# EAGLE design The Watch v1.1 (EAGLE 9.3.2)
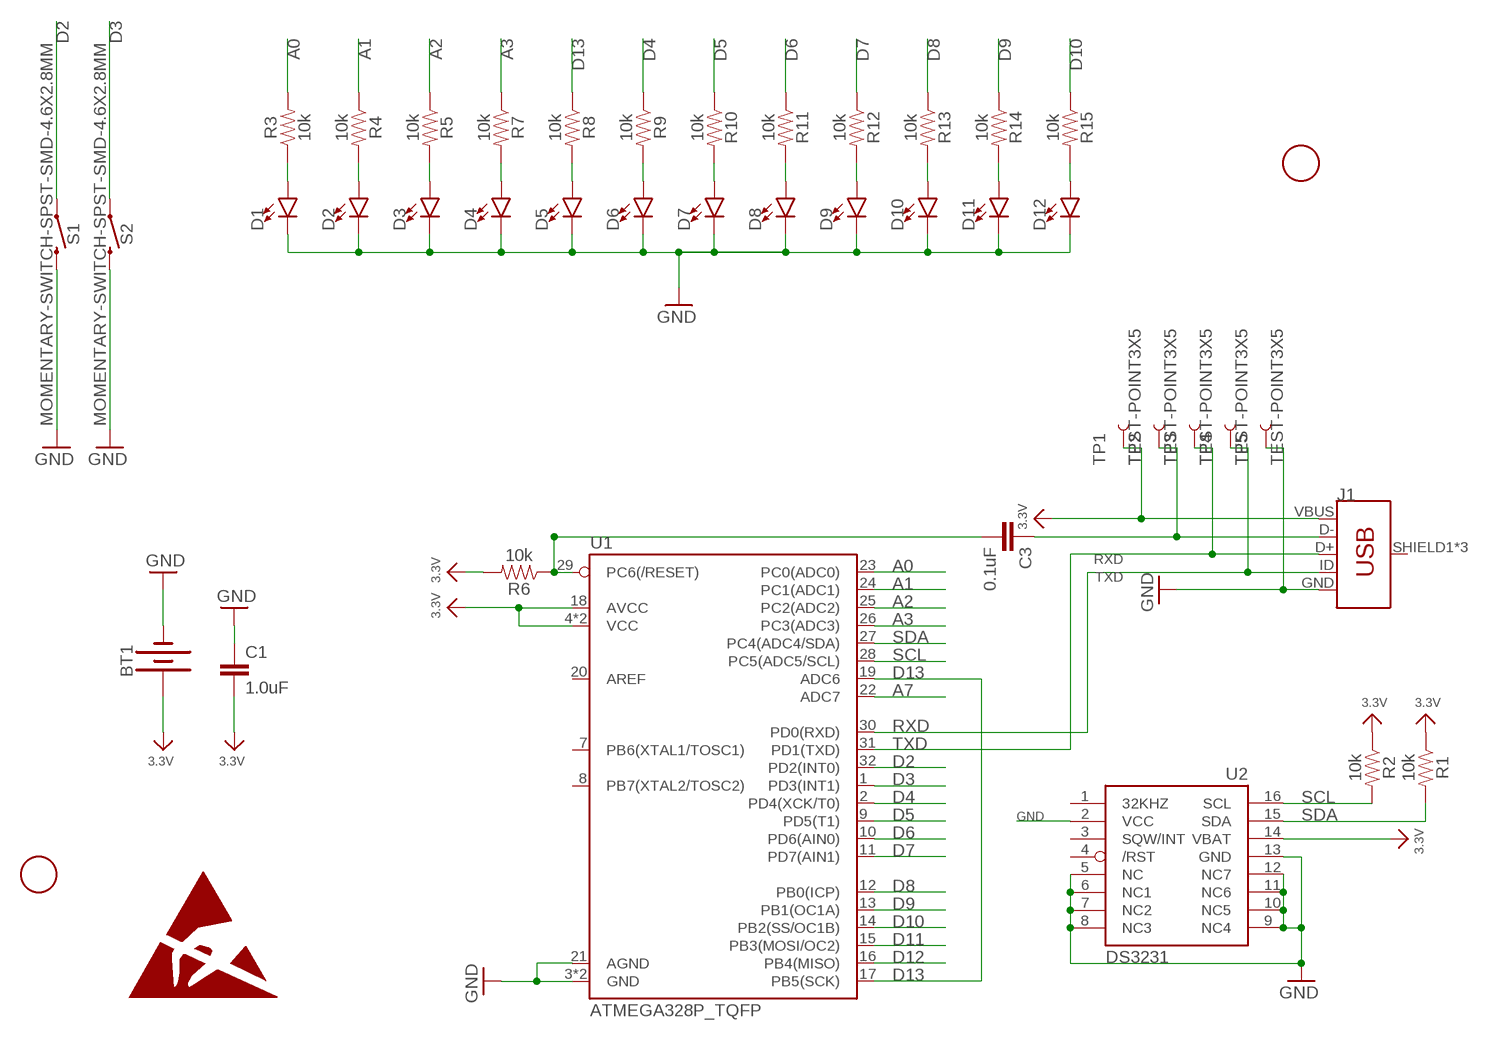
[diagram p0: schematic, sheet 1]

## Parts
BT1  BATTERY-20MM_SMD_4LEGS_OVERPASTE  [BATTCON_20MM_4LEGS_OVERPASTE]
C1  1.0uF  1.0UF-0603-16V-10%  [0603]
C3  0.1uF  0.1UF-0603-25V-5%  [0603]
D1  LED0603  [LED-0603]
D2  LED0603  [LED-0603]
D3  LED0603  [LED-0603]
D4  LED0603  [LED-0603]
D5  LED0603  [LED-0603]
D6  LED0603  [LED-0603]
D7  LED0603  [LED-0603]
D8  LED0603  [LED-0603]
D9  LED0603  [LED-0603]
D10  LED0603  [LED-0603]
D11  LED0603  [LED-0603]
D12  LED0603  [LED-0603]
J1  USB_MICRO-B_FEMALE-SMT  [USB-B-MICRO-SMD]
R1  10k  10KOHM-0603-1/10W-1%  [0603]
R2  10k  10KOHM-0603-1/10W-1%  [0603]
R3  10k  10KOHM-0603-1/10W-1%  [0603]
R4  10k  10KOHM-0603-1/10W-1%  [0603]
R5  10k  10KOHM-0603-1/10W-1%  [0603]
R6  10k  10KOHM-0603-1/10W-1%  [0603]
R7  10k  10KOHM-0603-1/10W-1%  [0603]
R8  10k  10KOHM-0603-1/10W-1%  [0603]
R9  10k  10KOHM-0603-1/10W-1%  [0603]
R10  10k  10KOHM-0603-1/10W-1%  [0603]
R11  10k  10KOHM-0603-1/10W-1%  [0603]
R12  10k  10KOHM-0603-1/10W-1%  [0603]
R13  10k  10KOHM-0603-1/10W-1%  [0603]
R14  10k  10KOHM-0603-1/10W-1%  [0603]
R15  10k  10KOHM-0603-1/10W-1%  [0603]
S1  MOMENTARY-SWITCH-SPST-SMD-4.6X2.8MM  [TACTILE_SWITCH_SMD_4.6X2.8MM]
S2  MOMENTARY-SWITCH-SPST-SMD-4.6X2.8MM  [TACTILE_SWITCH_SMD_4.6X2.8MM]
TP1  TEST-POINT3X5  [PAD.03X.05]
TP2  TEST-POINT3X5  [PAD.03X.05]
TP3  TEST-POINT3X5  [PAD.03X.05]
TP4  TEST-POINT3X5  [PAD.03X.05]
TP5  TEST-POINT3X5  [PAD.03X.05]
U1  ATMEGA328P_TQFP  [TQFP32-08]
U2  DS3231/SO  [SO16W]
U$1  FIDUCIAL  [FIDUCIAL_1MM]
U$10  FIDUCIAL  [FIDUCIAL_1MM]

## Nets
3.3V: BT1.1(+) C1.2 J1.VBUS R1.1 R2.1 R6.2 TP1.P$1 U1.4(VCC) U1.6(VCC) U1.18(AVCC) U2.14(VBAT)
A0: R3.2 U1.23(PC0(ADC0))
A1: R4.1 U1.24(PC1(ADC1))
A2: R5.1 U1.25(PC2(ADC2))
A3: R7.1 U1.26(PC3(ADC3))
A7: U1.22(ADC7)
D2: S1.1 S1.2 U1.32(PD2(INT0))
D3: S2.1 S2.2 U1.1(PD3(INT1))
D4: R9.1 U1.2(PD4(XCK/T0))
D5: R10.1 U1.9(PD5(T1))
D6: R11.1 U1.10(PD6(AIN0))
D7: R12.1 U1.11(PD7(AIN1))
D8: R13.1 U1.12(PB0(ICP))
D9: R14.1 U1.13(PB1(OC1A))
D10: R15.1 U1.14(PB2(SS/OC1B))
D11: U1.15(PB3(MOSI/OC2))
D12: U1.16(PB4(MISO))
D13: R8.1 U1.17(PB5(SCK)) U1.19(ADC6)
GND [power]: BT1.2(-) C1.1 D1.C D2.C D3.C D4.C D5.C D6.C D7.C D8.C D9.C D10.C D11.C D12.C J1.GND S1.3 S1.4 S2.3 S2.4 TP5.P$1 U1.3(GND) U1.5(GND) U1.21(AGND) U2.2(VCC) U2.5(NC) U2.6(NC1) U2.7(NC2) U2.8(NC3) U2.9(NC4) U2.10(NC5) U2.11(NC6) U2.12(NC7) U2.13(GND)
N$3: D1.A R3.1
N$4: D2.A R4.2
N$5: D3.A R5.2
N$6: D4.A R7.2
N$7: D5.A R8.2
N$8: D6.A R9.2
N$9: D7.A R10.2
N$10: D8.A R11.2
N$11: D9.A R12.2
N$12: D10.A R13.2
N$13: D11.A R14.2
N$14: D12.A R15.2
N$20: C3.1 J1.D- TP2.P$1
RESET: C3.2 R6.1 U1.29(PC6(/RESET))
RXD: J1.ID TP4.P$1 U1.30(PD0(RXD))
SCL: R2.2 U1.28(PC5(ADC5/SCL)) U2.16(SCL)
SDA: R1.2 U1.27(PC4(ADC4/SDA)) U2.15(SDA)
TXD: J1.D+ TP3.P$1 U1.31(PD1(TXD))
Unconnected: J1.SHIELD1(SHIELD) J1.SHIELD2(SHIELD) J1.SHIELD3(SHIELD) U1.7(PB6(XTAL1/TOSC1)) U1.8(PB7(XTAL2/TOSC2)) U1.20(AREF) U2.1(32KHZ) U2.3(SQW/INT) U2.4(/RST)

## Library data of the parts
BT1 = SparkFun-Batteries:BATTERY: Battery - Single Cell A variety of battery chemistries, sizes, and footprints. Device List: 20MM_PTH - Coin Cell Battery Holder - 20mm (PTH) <https://www.sparkfun.com/products/783> 6.8MM_PTH - Coin Cell Battery Holder - 6.8MM(SMD) <https://www.digikey.com/product-detail/en/seiko-instruments/MS621FE-FL11E/728-1057-ND/1889208?WT.srch=1&gclid=CNOQ5a6LzdQCFZS2wAodXCkE0g> 12MM_SMD - Coin Cell Battery Holder - 12mm (SMD) <https://www.sparkfun.com/products/10592> 12MM_PTH - Coin Cell Battery Holder - 12mm (PTH) <https://www.sparkfun.com/products/7948> 20MM_SMD - 20mm Coin Cell Battery Holder (SMD) (2 legs) Used on the Big Time Watch Kit <https://www.sparkfun.com/products/11734> 20MM_SMD_4LEGS - Coin Cell Battery Holder - 20mm (SMD) <https://www.sparkfun.com/products/11892> 20MM_SMD_4LEGS_OVERPASTE - Coin Cell Battery Holder - 20mm (SMD) <https://www.sparkfun.com/products/11892> (Over-paste on the legs) 24.5MM_PTH - Coin Cell Battery Holder - 24.5mm (PTH) <https://www.sparkfun.com/products/8863> 9V - 9V Battery Holder - PC Mount Used on the SparkFun SparkPunk Sound Kit <https://www.sparkfun.com/products/11177> and SparkFun SparkPunk Sequencer Kit <https://www.sparkfun.com/products/12707> 18650 - Battery Holder - 18650 (PTH) <https://www.sparkfun.com/products/13113> AA - Battery Holder - 1xAA (PTH) <https://www.sparkfun.com/products/7949> AAA - Battery Holder - 1xAAA (PTH) <https://www.sparkfun.com/products/12718> AA_KIT - Battery Holder - 1xAA (PTH) <https://www.sparkfun.com/products/7949> Special kit package - pads only have exposed copper on one side of the board. AAA_KIT - Battery Holder - 1xAAA (PTH) <https://www.sparkfun.com/products/12718> Special kit package - pads only have exposed copper on one side of the board.; PROD_ID: PRT-11892; SF_SKU: BATT-10373
C1 = SparkFun-Capacitors:1.0UF: 1µF ceramic capacitors A capacitor is a passive two-terminal electrical component used to store electrical energy temporarily in an electric field.; PROD_ID: CAP-00868
C3 = SparkFun-Capacitors:0.1UF: 0.1µF ceramic capacitors A capacitor is a passive two-terminal electrical component used to store electrical energy temporarily in an electric field.; PROD_ID: CAP-08604
D1 = SparkFun-LED:LED: LED (Generic) Standard schematic elements and footprints for 5mm, 3mm, 1206, and 0603 sized LEDs. Generic LEDs with no color specified.; SPICEPREFIX: D
D2-D12 = SparkFun-LED:LED: LED (Generic) Standard schematic elements and footprints for 5mm, 3mm, 1206, and 0603 sized LEDs. Generic LEDs with no color specified.
J1 = SparkFun-Connectors:USB_MICRO-B: USB Type Micro-B Connector Male/female and PTH/SMT variants SparkFun Products: SparkFun microB USB Breakout <https://www.sparkfun.com/products/12035> SparkFun USB microB Plug Breakout <https://www.sparkfun.com/products/10031> SparkFun ESP8266 Thing <https://www.sparkfun.com/products/13231>; PROD_ID: CONN-11752
R1-R15 = SparkFun-Resistors:10KOHM: 10kΩ resistor A resistor is a passive two-terminal electrical component that implements electrical resistance as a circuit element. Resistors act to reduce current flow, and, at the same time, act to lower voltage levels within circuits. - Wikipedia; PROD_ID: RES-00824
S1 S2 = SparkFun-Switches:MOMENTARY-SWITCH-SPST: Momentary Switch (Pushbutton) - SPST Normally-open (NO) SPST momentary switches (buttons, pushbuttons). Variants PTH-12MM - 12mm square, through-hole Momentary Pushbutton Switch - 12mm Square <https://www.sparkfun.com/products/9190> (COM-09190) PTH-6.0MM, PTH-6.0MM-KIT - 6.0mm square, through-hole Mini Pushbutton Switch <https://www.sparkfun.com/products/97> (COM-00097) KIT package intended for soldering kit's - only one side of pads' copper is exposed. PTH-RIGHT-ANGLE-KIT - Right-angle, through-hole Right Angle Tactile Button <https://www.sparkfun.com/products/10791> - Used on SparkFun BigTime Watch Kit <https://www.sparkfun.com/products/11734> SMD-12MM - 12mm square, surface-mount Tactile Button - SMD (12mm) <https://www.sparkfun.com/products/12993> (COM-12993) Used on SparkFun PicoBoard <https://www.sparkfun.com/products/11888> SMD-4.5MM - 4.5mm Square Trackball Switch Used on SparkFun Blackberry Trackballer Breakout <https://www.sparkfun.com/products/13169> SMD-4.6MMX2.8MM - 4.60mm x 2.80mm, surface mount Used on SparkFun SAMD21 Mini Breakout <https://www.sparkfun.com/products/13664> SMD-5.2MM, SMD-5.2-REDUNDANT - 5.2mm square, surface-mount Mini Pushbutton Switch - SMD <https://www.sparkfun.com/products/8720> (COM-08720) Used on Arduino Pro Mini <https://www.sparkfun.com/products/11114> REDUNDANT package connects both switch circuits together SMD-6.0X3.5MM - 6.0 x 3.5mm, surface mount Momentary Reset Switch SMD <https://www.sparkfun.com/products/8229> (COM-08229) SMD-6.2MM-TALL - 6.2mm square, surface mount Tactile Button - SMD (6mm) <https://www.sparkfun.com/products/12992> Used on SparkFun Digital Sandbox <https://www.sparkfun.com/products/12651> SMD-RIGHT-ANGLE - Right-angle, surface mount Used on SparkFun Block for Intel® Edison - Arduino <https://www.sparkfun.com/products/13036>; PROD_ID: SWCH-13065
TP1-TP5 = SparkFun-Connectors:TEST-POINT: SparkFun Test Points Bare copper test points for troubleshooting or In-Circuit-Testing. These are used by our Production team for verifying production board runs using pogo-pins on test beds. SparkFun Products: SparkFun LSM9DS1 Breakout <https://www.sparkfun.com/products/13284> SparkFun PSOC <https://www.sparkfun.com/products/13714> SparkFun Load Cell Amplifier <https://www.sparkfun.com/products/13879>
U1 = SparkFun-IC-Microcontroller:ATMEGA328P_TQFP: Popular 328P in QFP Storefront component: ATmega328 - TQFP <https://www.sparkfun.com/products/13448> (COM-13448) Datasheet <http://www.sparkfun.com/datasheets/Components/SMD/ATMega328.pdf> SparkFun Products SparkFun RedBoard - Programmed with Arduino <https://www.sparkfun.com/products/12757> (DEV-12757) Arduino Pro Mini 328 - 5V/16MHz <https://www.sparkfun.com/products/11113> (DEV-11113) Arduino Pro Mini 328 - 3.3V/8MHz <https://www.sparkfun.com/products/11114> (DEV-11114) SparkFun OpenLog <https://www.sparkfun.com/products/13712> (DEV-13712) SparkFun MicroView - OLED Arduino Module <https://www.sparkfun.com/products/12923> (DEV-12923) SparkFun Digital Sandbox <https://www.sparkfun.com/products/12651> (DEV-12651) SparkFun PicoBoard <https://www.sparkfun.com/products/11888> (WIG-11888) Arduino Fio <https://www.sparkfun.com/products/10116> (DEV-10116) LilyPad Arduino 328 Main Board <https://www.sparkfun.com/products/13342> (DEV-13342) SparkFun RedStick <https://www.sparkfun.com/products/13741> (DEV-13741) LilyPad MP3 <https://www.sparkfun.com/products/11013> (DEV-11013) LilyPad Arduino SimpleSnap <https://www.sparkfun.com/products/10941> (DEV-10941) SparkFun Stepoko <https://www.sparkfun.com/products/13899> (ROB-13899) SparkFun Geiger Counter <https://www.sparkfun.com/products/11345> (SEN-11345) SparkFun EL Sequencer <https://www.sparkfun.com/products/12781> (COM-12781) Arduino Pro 328 - 5V/16MHz <https://www.sparkfun.com/products/10915> (DEV-10915) CryptoCape <https://www.sparkfun.com/products/12773> (DEV-12773) SparkFun IR Thermometer Evaluation Board - MLX90614 <https://www.sparkfun.com/products/10740> (SEN-10740) SparkFun RedBot Mainboard <https://www.sparkfun.com/products/12097> (ROB-12097) Arduino Pro 328 - 3.3V/8MHz <https://www.sparkfun.com/products/10914> (DEV-10914) SparkFun Block for Intel® Edison - Arduino <https://www.sparkfun.com/products/13036> (DEV-13036) SparkFun Simon Says - Surface Mount Soldering Kit <https://www.sparkfun.com/products/10935> (KIT-10935) SparkFun 7-Segment Serial Display - Red <https://www.sparkfun.com/products/11441> (COM-11441) SparkFun 7-Segment Serial Display - White <https://www.sparkfun.com/products/11629> (COM-11629) SparkFun 7-Segment Serial Display - Yellow <https://www.sparkfun.com/products/11443> (COM-11443) SparkFun 7-Segment Serial Display - Kelly Green <https://www.sparkfun.com/products/11440> (COM-11440) SparkFun 7-Segment Serial Display - Blue <https://www.sparkfun.com/products/11442> (COM-11442) SparkFun OpenSegment Serial Display - 20mm (Blue) <https://www.sparkfun.com/products/11647> (COM-11647) SparkFun OpenSegment Serial Display - 20mm (Green) <https://www.sparkfun.com/products/11646> (COM-11646) SparkFun OpenSegment Serial Display - 20mm (White) <https://www.sparkfun.com/products/11648> (COM-11648) SparkFun OpenSegment Serial Display - 20mm (Red) <https://www.sparkfun.com/products/11644> (COM-11644) SparkFun OpenSegment Serial Display - 20mm (Yellow) <https://www.sparkfun.com/products/11645> (COM-11645) SparkFun OpenSegment Shield <https://www.sparkfun.com/products/13190> (DEV-13190); PROD_ID: IC-09069; SPICEPREFIX: X
U2 = adafruit:DS3231
U$1 U$10 = adafruit:FIDUCIAL: For use by pick and place machines to calibrate the vision/machine, 1mm By microbuilder.eu

## Net classes
1 power: width 0.305 mm

## Board
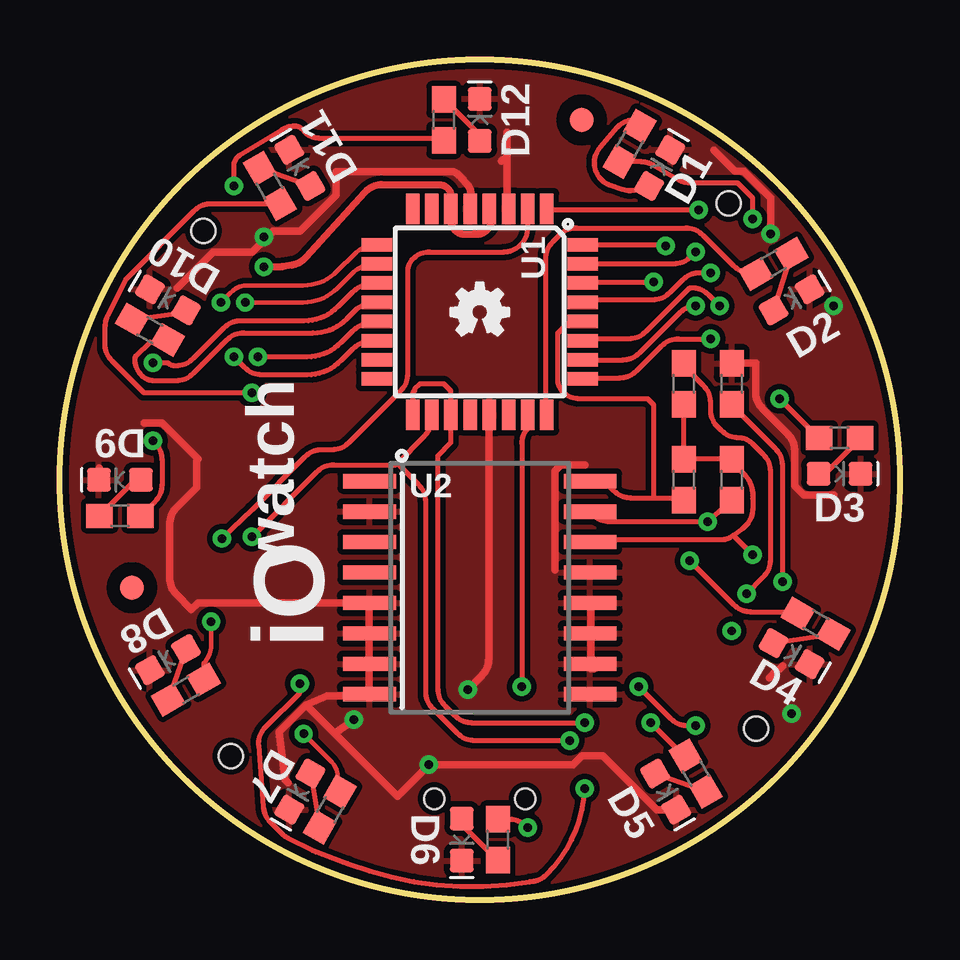
[diagram p1: board, top side]
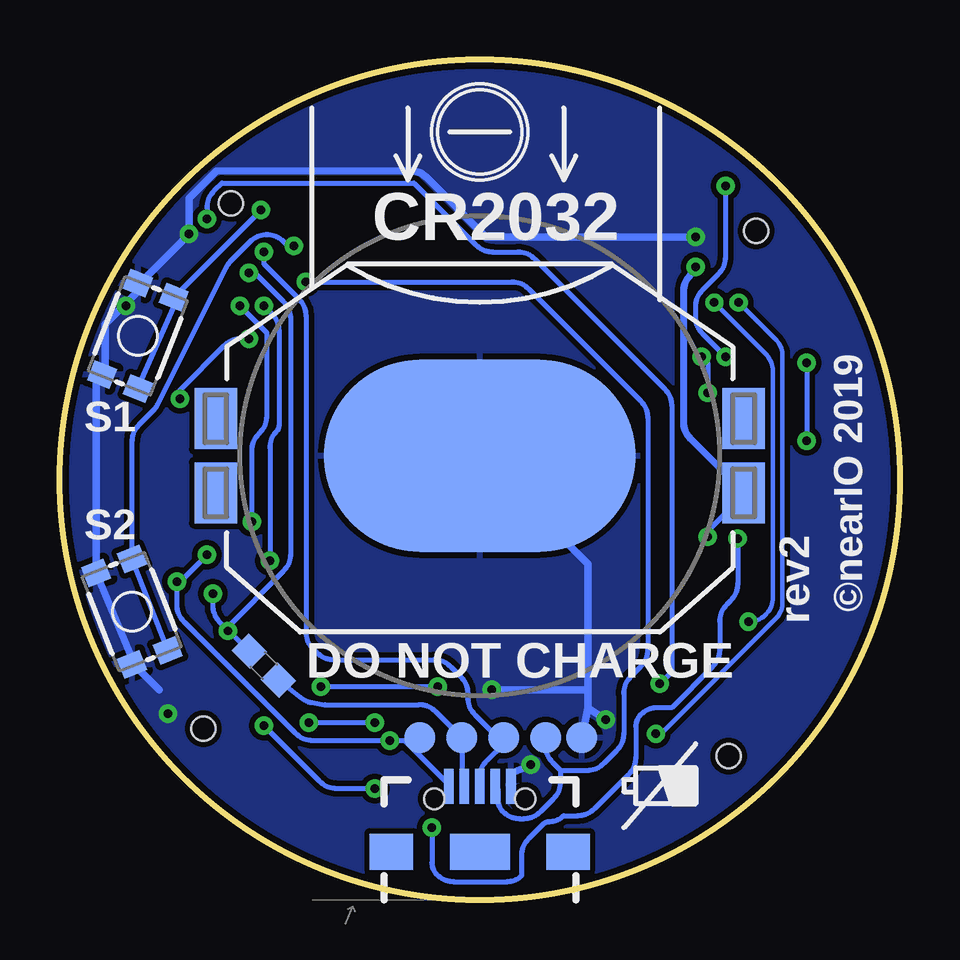
[diagram p2: board, bottom side, seen from below]

Size 35 x 35 mm. Coordinates in mm from the lower left corner, seen from the top.
Outline: circle at 17.5,17.5 radius 17.5
Copper layers (1*16): Top 0.035mm / dielectric 1.5mm / Bottom 0.035mm
Design rules "default *": minimum track width 7mil, minimum drill 0.35mm, track to track 9mil, track to pad 8mil, pad to pad 8mil, via to via 8mil, smd to smd 8mil, copper to edge 10mil, drill to drill 6mil, minimum pad ring 10mil, minimum via ring 8mil, stop-mask expansion 4mil, vias tented up to drill 15mil, thermal gap 10mil
Holes 1 mm at 7.13,5.98 5.98,27.87 29.02,7.13 27.87,29.02
vRestrict: area 11.2,12.2 to 23.8,24.8; area 9,22 to 26,36.5

### Footprints (pad centres in the part's own frame; a part is rotated, then mirrored left to right if it is on the bottom)
BATTCON_20MM_4LEGS_OVERPASTE = smd 1.778 x 2.54: 1 -11,1.55; 3 11,1.55; P$1 -11,-1.55; P$2 11,-1.55 | smd 13 x 8: 2 0,0
0603 = smd 1.1 x 1: 1 -0.85,0; 2 0.85,0
LED-0603 = smd 1 x 1: A -0.877,0; C 0.877,0
USB-B-MICRO-SMD = smd 1.45 x 0.4: D+ 2.725,0; D- 2.725,0.65; GND 2.725,-1.3; ID 2.725,-0.65; VBUS 2.725,1.3 | smd 1.5 x 1.8: SHIELD1 0,3.685; SHIELD2 0,-3.685 | smd 1.5 x 2.5: SHIELD3 0,0 | hole 0.85: 2.2,1.9; 2.2,-1.9
TACTILE_SWITCH_SMD_4.6X2.8MM = smd 0.9 x 1: 1 -2.05,-0.8; 2 2.05,-0.8; 3 2.05,0.8; 4 -2.05,0.8
PAD.03X.05 = smd 1.27 x 1.27: P$1 0,0
TQFP32-08 = smd 1.27 x 0.559: 1 -4.293,2.8; 2 -4.293,2; 3 -4.293,1.2; 4 -4.293,0.4; 5 -4.293,-0.4; 6 -4.293,-1.2; 7 -4.293,-2; 8 -4.293,-2.8; 17 4.293,-2.8; 18 4.293,-2; 19 4.293,-1.2; 20 4.293,-0.4; 21 4.293,0.4; 22 4.293,1.2; 23 4.293,2; 24 4.293,2.8 | smd 0.559 x 1.27: 9 -2.8,-4.293; 10 -2,-4.293; 11 -1.2,-4.293; 12 -0.4,-4.293; 13 0.4,-4.293; 14 1.2,-4.293; 15 2,-4.293; 16 2.8,-4.293; 25 2.8,4.293; 26 2,4.293; 27 1.2,4.293; 28 0.4,4.293; 29 -0.4,4.293; 30 -1.2,4.293; 31 -2,4.293; 32 -2.8,4.293
SO16W = smd 0.6 x 2.2: 1 -4.445,-4.6; 2 -3.175,-4.6; 3 -1.905,-4.6; 4 -0.635,-4.6; 5 0.635,-4.6; 6 1.905,-4.6; 7 3.175,-4.6; 8 4.445,-4.6; 9 4.445,4.6; 10 3.175,4.6; 11 1.905,4.6; 12 0.635,4.6; 13 -0.635,4.6; 14 -1.905,4.6; 15 -3.175,4.6; 16 -4.445,4.6
FIDUCIAL_1MM = smd 1 x 1: 1 0,0

### Placement (x,y rotation side)
BT1  17.5,18.5 180 bottom
C1  28,21.5 270 top
C3  26.5,9.75 135 bottom
D1  25,30.5 60 top
D2  30.5,25 30 top
D3  32.5,17.75 0 top
D4  30.5,10.25 330 top
D5  25.25,4.5 300 top
D6  16.75,2.5 270 top
D7  10,4.5 240 top
D8  4.5,10 210 top
D9  2.5,17.5 180 top
D10  4.5,25 150 top
D11  10,30.5 120 top
D12  17.5,32.5 90 top
J1  17.5,2 90 bottom
R1  28,17.5 270 top
R2  26,17.5 270 top
R3  23.75,31.5 240 top
R4  29.75,26.5 30 top
R5  32.5,19.25 0 top
R6  26,21.5 270 top
R7  31.5,11.5 330 top
R8  26.5,5.25 300 top
R9  18.25,2.5 270 top
R10  11.25,3.75 240 top
R11  5.25,8.75 210 top
R12  2.5,16 180 top
R13  3.75,23.75 150 top
R14  8.75,29.75 120 top
R15  16,32.5 90 top
S1  32,12 111.4 bottom
S2  31.75,23.5 68.6 bottom
TP1  20,6.75 0 bottom
TP2  18.25,6.75 0 bottom
TP3  16.5,6.75 0 bottom
TP4  14.75,6.75 0 bottom
TP5  13.25,6.75 0 bottom
U1  17.5,24.5 270 top
U2  17.5,13 270 top
U$1  3,13 0 top
U$6  [OSHW-LOGO-MINI]  17.5,24.5 0 top
U$10  21.75,32.5 0 top

### Tracks (layer width: path | path; a pad name or v marks a point on that pad's centre or on a via)
3.3V  (via drill 0.35)
  Top 0.178: 7.92,15.04 v8,15.12
  Top 0.203: 16.38,28.75 U1.6 16.25,28.88 | 17.88,28.75 U1.4 | 14.06,18.19 15.21,19.33 arc45 15.5,20.04 U1.18 | 14.06,18.19 14,18.12 11.41,18.12 arc45 10.71,17.83 v8,15.12 | 26,18.38 28,18.38 R1.1 28,18.25 28.58,17.67 arc-45 28.88,16.71 28.88,16.27 arc-55 28.44,15.45 28.06,15.19 | 26,18.38 R6.2 | 26,18.38 R2.1 | 28.06,15.19 arc-45 27.61,15 22.12,15 U2.14 | v30.12,13.25 30.12,18.09 arc45 29.83,18.79 28,20.62 C1.2 | v28.88,14.38 28.06,15.19 | 14.06,18.19 14.96,17.29 arc-45 15.25,16.59 15.25,8.66 arc45 15.54,7.96 16.58,6.92 arc45 17.29,6.62 v21.25,6.62
  Top 0.254: 16.25,28.88 16.25,29.05 arc45 16.38,28.75
  Top 0.3: v8.5,26.38 9.17,26.38 arc9 9.33,26.39 9.66,26.44 arc38 10.23,26.76 12.7,29.47 arc-48 13.44,29.8 15.81,29.8 arc-83 16.3,29.36 16.38,28.75 | U1.6 16.3,28.45 arc90 16.75,27.75 17.25,27.75 arc90 18,28.25 18,28.62 arc90 17.88,28.75
  Bottom 0.203: v8,15.12 8,15.38 6.5,16.88 BT1.1 6.5,17 | 8.5,26.25 v8.5,26.38 | 30.12,13.12 30.12,12.29 arc-45 29.83,11.58 25.17,6.92 arc-45 24.46,6.62 v21.25,6.62 20.62,6.62 | 20.62,6.62 20.12,6.62 TP1.P$1 20.62,6.62 | 20.62,6.62 18.75,4.75 J1.VBUS | 30.12,13.12 v28.88,14.38 | 30.12,13.12 v30.12,13.25
  Bottom 0.3: 6.5,17 8.71,19.21 arc45 9,19.91 9,25.34 arc45 8.71,26.04 8.5,26.25
A0  (via drill 0.35)
  Top 0.2: 10.53,2.05 12,1.5 arc10 14.75,0.75 arc20 19.59,0.75 | 20.29,1.04 arc42 v21.88,4.62
  Top 0.203: v28.88,28.38 28.88,29.25 28.25,29.88 26.27,29.88 arc-30 25.77,30.01 24.73,30.62 arc30 24.24,30.75 R3.2 23.38,30.75 | v10,9 10,8.62 8.57,7.2 arc49 8.28,6.42 8.47,3.87 arc41 8.76,3.24 9.26,2.74 arc18 9.52,2.55 10.53,2.05 10.66,1.98 | 19.59,0.75 arc45 20.29,1.04 | v24.12,8.88 25.46,7.54 arc45 26.16,7.25 v26.5,7.25 | v19.25,8.88 19.25,19.02 arc-45 19.5,19.62 U1.23
  Bottom 0.2: 20.25,29.88 17.67,27.29 arc-45 16.96,27 15.91,27 arc45 15.21,26.71 9.79,21.29 arc45 9.5,20.59 9.5,9.5 v10,9 | v21.88,4.62 23.46,4.62 arc45 24.17,4.92 v26.5,7.25
  Bottom 0.203: v28.88,28.38 28.88,28.84 arc45 28.58,29.54 28.25,29.88 20.25,29.88 | v19.25,8.88 v24.12,8.88
A1
  Top 0.203: R4.1 29,26.12 28.79,26.12 arc-45 28.08,26.42 26.79,27.71 arc45 26.09,28 21.54,28 arc45 20.83,27.71 20.54,27.42 arc45 20.25,26.71 20.25,20.25 U1.24
A2  (via drill 0.35)
  Top 0.203: v30,20.88 31.62,19.25 R5.1 | v27.12,23.38 25.79,23.38 arc45 25.08,23.08 24.04,22.04 arc-45 23.34,21.75 21.88,21.75 U1.25
  Bottom 0.203: v30,20.88 30,21.25 28.17,23.08 arc45 27.46,23.38 v27.12,23.38
A3  (via drill 0.35)
  Top 0.203: v26.25,14.12 28.08,12.29 arc45 28.79,12 30.75,12 R7.1 | v26.5,24.75 arc45 25.86,24.48 24.17,22.79 arc-45 23.46,22.5 U1.26
  Bottom 0.203: v26.5,24.75 26.17,24.42 arc45 25.88,23.71 25.88,19.74 arc45 25.96,19.54 arc-45 26.25,18.84 v26.25,14.12
D2  (via drill 0.35)
  Top 0.2: U1.32 25.2,27.3 v25.25,27.25
  Bottom 0.2: S1.2 32,19.08 arc45 31.71,19.79 31.11,20.39 arc-18 30.93,20.64 28.07,26.36 arc18 27.89,26.61 27.08,27.42 arc90 25.67,27.42 25.5,27.25 v25.25,27.25
  Bottom 0.203: S1.2 S1.1
D3  (via drill 0.35)
  Top 0.203: v26.62,28.75 20.38,28.75 U1.1
  Bottom 0.2: S2.1 29.94,25.44
  Bottom 0.203: 31.75,21.38 S2.1 | 30.38,25 S2.2 29.94,25.44 v26.62,28.75
D4  (via drill 0.35)
  Top 0.203: v6.75,15.05 8,16.25 10.21,18.46 arc-45 10.91,18.75 11.34,18.75 arc45 12.04,19.04 14.21,21.21 arc45 14.5,21.91 14.5,26.21 arc-45 14.71,26.71 arc-45 15.41,27 18.5,27 arc90 19.5,28 U1.2 | R9.1 18.74,3.35 arc-45 19.44,3.06 v19.5,3
  Bottom 0.203: v6.75,15.05 6.75,13.16 arc45 7.04,12.46 7.21,12.29 arc-45 7.5,11.59 7.5,10.41 arc45 7.79,9.71 9.5,8 10.09,8 arc-45 10.79,7.71 arc-45 11,7.21 11,5.91 arc45 11.29,5.21 12.71,3.79 arc45 13.41,3.5 14,3.5 arc45 14.6,3.25 arc-45 14.85,3.15 15.46,2.54 arc-45 15.75,1.84 15.75,1 arc45 16.35,0.75 18.59,0.75 arc45 19.29,1.04 arc45 19.5,1.54 v19.5,3
D5  (via drill 0.35)
  Top 0.178: v10.16,6.91 11.29,5.78 arc-45 11.58,5.07 11.58,4.57 R10.1 | v6.71,24.89 7.12,25.31 arc-45 7.83,25.6 10.14,25.6 arc45 11.56,26.19 12.31,26.94 arc-45 13.01,27.23 13.11,27.23 U1.9
  Bottom 0.178: v10.16,6.91 9.96,6.91 5.17,11.7 arc-45 4.88,12.4 4.88,22.65 arc-45 5.17,23.36 v6.71,24.89
D6  (via drill 0.35)
  Top 0.178: v6.3,11.58 6.3,10.57 arc-45 6.01,9.87 arc45 5.99,9.84 5.99,9.25 R11.1 | v7.72,24.89 10.14,24.89 arc45 11.56,25.48 12.2,26.12 arc-45 12.91,26.42 13.11,26.42 U1.10
  Bottom 0.178: v7.72,24.89 5.58,22.75 arc45 5.28,22.04 5.28,12.58 arc90 6.28,11.58 v6.3,11.58
D7  (via drill 0.35)
  Top 0.203: v3.88,19.12 3.96,19.04 arc-45 4.25,18.34 4.25,17.29 arc-45 3.96,16.58 3.38,16 R12.1 | v3.88,22.38 4.5,22.38 arc45 4.8,22.25 4.84,22.25 arc45 5.54,22.54 6.83,23.83 arc-45 7.54,24.12 10.17,24.12 arc45 11.59,24.71 12.21,25.33 arc-45 12.91,25.62 13.12,25.62 U1.11
  Bottom 0.203: v3.88,22.38 v3.88,19.12
D8
  Top 0.2: 7.66,23.62 10.55,23.62 arc45 11.96,24.21 12.29,24.54 arc-33 12.79,24.81 U1.12
  Top 0.203: 7.66,23.62 arc45 6.96,23.33 5.54,21.92 arc-45 4.84,21.62 3.92,21.62 arc-45 3.42,21.83 arc-45 3.12,22.54 arc-45 3.19,22.69 3.75,23.25 4.38,23.25 R13.1 | U1.12 13.12,24.88
D9  (via drill 0.35)
  Top 0.203: v8,21.12 3.5,21.12 2.17,22.46 arc-45 1.88,23.16 1.88,23.89 arc-27 1.98,24.34 2.75,25.88 5.58,28.71 arc-45 6.29,29 9.12,29 R14.1 | v8.25,22.62 10.3,22.62 arc45 11.71,23.21 12.21,23.71 arc-45 12.91,24 13.12,24 U1.13
  Bottom 0.203: v8,21.12 8,22.38 v8.25,22.62
D10  (via drill 0.35)
  Top 0.203: v7.25,29.75 7.25,30.59 arc-59 7.49,31.02 9.26,32.1 arc-31 9.78,32.25 arc-53 10.13,32.08 arc53 10.78,31.75 16,31.75 R15.1 | v7.25,22.62 7.71,22.17 arc45 8.41,21.88 10.3,21.88 arc45 11.71,22.46 12.21,22.96 arc-45 12.91,23.25 13.12,23.25 U1.14
  Bottom 0.203: v7.25,29.75 7.25,26.79 arc45 7.54,26.08 8.21,25.42 arc-45 8.5,24.71 8.5,24.29 arc-45 8.21,23.58 v7.25,22.62
D13  (via drill 0.35)
  Top 0.2: 15.75,18.5 16.3,19.05 U1.19 16.3,21.2 16,21.5 15,21.5 14.78,21.28 14.78,21.22 14.7,21.13 U1.17
  Top 0.203: v24.62,7.38 26,6 R8.1 | v21.88,7.38 17.16,7.38 arc-45 16.46,7.67 16.04,8.08 arc-45 15.75,8.79 15.75,18.5
  Bottom 0.203: v21.88,7.38 v24.62,7.38
GND  (via drill 0.35)
  Top 0.305: 17.5,33.12 D12.C | 18.62,30.88 18.62,28.88 U1.3 | 18.62,30.88 18.62,32 | 18.41,30.79 arc-45 18.62,30.88 | U1.5 17.12,28.88 17.12,29.5 arc41 17.04,29.72 16.65,30.18 arc49 16.27,30.35 11.5,30.35 11.5,29.38 10,27.88 8.88,27.88 8.56,27.56 | 4.88,25.5 6.38,27 8,27 8.56,27.56 | 3.75,25.5 D10.C | 9.62,31.25 D11.C | 31.25,25.38 D2.C | C1.1 28,22.38 29,22.38 29,21.16 arc45 29.29,20.46 30.33,19.42 arc-45 30.62,18.71 30.62,17.25 31,16.88 32.25,16.88 | 33.12,17.75 D3.C | 27.25,31.25 28.12,30.38 28.5,30.38 29.62,29.25 v29.62,27.75 | 25.5,31.25 D1.C | v8.5,27.62 8.56,27.56 | v17,8.75 17.58,9.33 arc45 17.88,10.04 17.88,20.12 U1.21 | 21.88,18.12 20.88,18.12 20.62,17.88 20.62,13.75 | 22,12.38 U2.12 22.12,12.25 22.12,11.12 U2.11 22.12,11 22.12,9.88 U2.10 | 22,13.62 U2.13 | D5.C 25.62,3.75 24.88,3.75 22.62,6 21.75,6 21.38,5.62 v15.38,5.62 14.06,4.31 11.44,6.94 | 22.12,8.5 U2.9 22.12,8.62 | 30.12,9.75 30,9.62 29.87,9.55 29.57,9.25 | 22.25,9.62 22.12,9.75 U2.10 | 31.25,9.75 D4.C | 22.12,9.62 U2.10 | 9.5,4.88 9.38,5 9.12,7 10.25,8.12 | 10.25,8.12 11.12,8.5 12.88,8.5 U2.8 12.88,8.62 12.88,9.75 U2.7 12.88,9.88 12.88,11 U2.6 12.88,11.25 12.88,12.25 U2.5 12.88,12.38 8.5,12.38 | 9.5,3.75 D7.C | 10.25,8.12 11.44,6.94 | D6.C | 8.5,12.38 5.75,12.38 5.48,12.1 4.87,12.71 arc-45 4.57,13.42 4.57,15.64 arc-45 4.87,16.35 5.69,17.17 5.69,18.29 5.75,18.38 4.25,19.88 3.5,19.88 | 3.75,9.62 D8.C | 1.62,18 D9.C | 12.12,16.12 12.88,16.12 U2.2 | 8.5,12.5 8.5,12.38 | 11.44,6.94 v12.25,7.5 | 22.35,9.65 U2.10
  Bottom 0.305: 32.31,24.81 31.75,25.38 31.75,25.62 S2.3 31.62,25.75 v29.62,27.75 29.62,29.25 28.5,30.38 20.41,30.39 arc45 19.71,30.09 17.25,27.62 v8.5,27.62 | 32.31,24.81 33.12,24 33.12,22 S2.4 33.25,21.75 33.5,21.5 33.5,13.75 S1.3 31.88,9.75 | v32.25,24.75 32.31,24.81 | 13,8.75 13,14 BT1.2 | 13,8 13,8.75 | 13,8 TP5.P$1 | 13,8.75 v17,8.75 | v15.38,5.62 16.25,5.25 16.2,5.2 J1.GND | 31.88,9.75 30.88,8.75 | 31.88,9.75 S1.4 | v12.25,7.5 13,8
  other vias: 30.5,7.75
  pour Top: -16,44.5 47.5,44.5 47.5,-8.5 -16,-8.5
  pour Bottom: -13.5,43 43.5,43 43.5,-6.5 -13.5,-6.5
N$3
  Top 0.203: R3.1 23.91,32.5 arc49 23.23,32.19 22.52,31.36 arc112 22.97,29.76 23.45,29.6 arc35 24.05,29.59 D1.A
N$4
  Top 0.203: R4.2 D2.A
N$5
  Top 0.203: D3.A 31.88,17.75 33.38,19.25 R5.2
N$6
  Top 0.203: D4.A R7.2
N$7
  Top 0.203: D5.A R8.2
N$8
  Top 0.203: D6.A 16.75,3.12 18.25,1.62 R9.2
N$9
  Top 0.203: D7.A R10.2
N$10
  Top 0.203: D8.A R11.2
N$11
  Top 0.203: D9.A 3.12,17.5 1.62,16 R12.2
N$12
  Top 0.203: D10.A 5.25,24.5 R13.2 3.12,24.25
N$13
  Top 0.203: D11.A R14.2
N$14
  Top 0.203: D12.A 17.5,31.88 16,33.38 R15.2
N$20
  Bottom 0.2: C3.1 24.95,8.41 arc-29 24.49,8.21 23.96,8.12
  Bottom 0.203: 25.38,9.12 25.88,9.12 C3.1 | 23.96,8.12 20.04,8.12 arc45 19.33,7.83 TP2.P$1 18.25,4.75 J1.D-
RESET  (via drill 0.35)
  Top 0.203: v28.62,12.75 29.33,13.46 arc45 29.62,14.16 29.62,17.84 arc45 29.33,18.54 28.86,19.01 arc45 28.29,19.25 arc-45 27.58,19.54 27.42,19.7 arc-45 27.12,20.4 27.12,20.71 arc45 26.83,21.42 26,22.25 R6.1 | v27.12,26.12 26.66,26.12 arc45 25.96,25.83 25.42,25.29 arc-45 24.71,25 21.88,25 U1.29
  Bottom 0.203: v28,11.2 28.36,11.59 arc43 28.62,12.27 v28.62,12.75 | v28,11.2 27.12,10.38 C3.2 | v28,11.2 28.06,11.31 25.67,13.71 arc-45 25.38,14.41 25.38,24.21 arc-45 25.67,24.92 26.88,26.12 v27.12,26.12
RXD  (via drill 0.35)
  Top 0.2: U1.30 21.84,25.75 v24.75,25.75
  Bottom 0.2: v24.75,25.75 16.16,25.75 arc45 15.46,25.46 10.79,20.79 arc45 10.5,20.09 10.5,10.41 arc45 10.79,9.71 11.21,9.29 arc-45 11.5,8.59 11.5,6.91 arc45 11.79,6.21 12.33,5.67 arc45 13.04,5.38 14.12,5.38
  Bottom 0.203: TP4.P$1 14.75,6.41 arc-45 14.46,5.71 14.12,5.38 14.12,4.91 arc45 14.42,4.21 14.96,3.67 arc45 15.66,3.38 15.84,3.38 arc45 16.54,3.67 arc45 16.75,4.17 16.75,4.62 J1.ID
SCL
  Top 0.203: 24.75,16.75 23.79,16.75 arc-45 23.08,17.04 22.75,17.38 22.12,17.38 U2.16 | 24.75,16.75 26,16.75 R2.2 | 24.75,16.75 24.75,20.62 24.5,20.88 21.66,20.88 arc-45 20.96,21.17 arc-45 20.75,21.67 20.75,23.62 21.12,24 21.75,24 U1.28
SDA  (via drill 0.35)
  Top 0.203: 28,16.62 R1.2 v27,15.75 22.91,15.75 arc-45 22.21,16.04 22.12,16.12 U2.15 | v27.5,24.75 27.04,25.21 arc45 26.34,25.5 arc45 26.19,25.44 24.42,23.67 arc-45 23.71,23.38 21.88,23.38 U1.27
  Bottom 0.203: v27.5,24.75 26.38,23.62 26.38,20.16 arc45 26.67,19.46 26.71,19.42 arc-45 27,18.71 v27,15.75
TXD  (via drill 0.35)
  Top 0.203: v26.5,27 26.29,26.79 arc-45 25.59,26.5 U1.31
  Bottom 0.2: 26.5,26.5 25.04,25.04 arc45 24.75,24.34 24.75,11.16 arc-45 24.46,10.46 24.29,10.29 arc-45 23.59,10 19.41,10 arc45 18.71,9.71 18.29,9.29 arc45 18,8.59 18,8.41 arc-45 17.71,7.71 16.5,6.5
  Bottom 0.203: J1.D+ 17.5,5.09 arc45 17.21,5.79 16.5,6.5 TP3.P$1 16.5,7.12 | 26.5,26.5 v26.5,27

### Text on the board
tNames: watch | iO
bNames: CR2032 | ©nearIO 2019 | S1 | S2 | rev2 | DO NOT CHARGE